# EAGLE design BMP280_breakout (EAGLE 7.2.0)
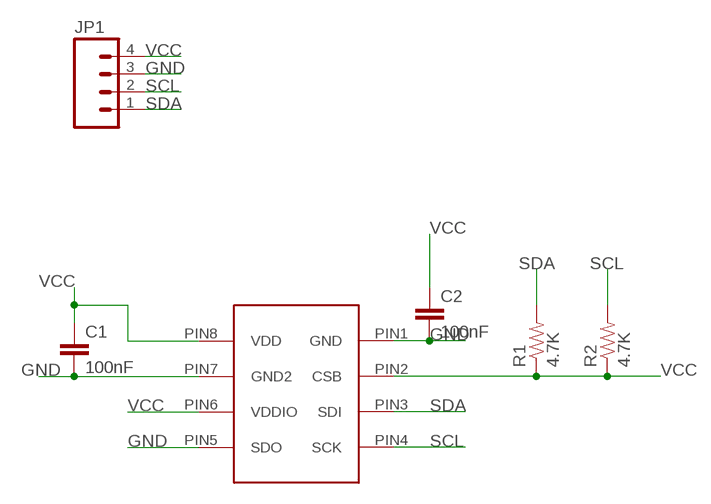
[diagram p0: schematic, sheet 1]

## Parts
C1  100nF  CAP0603-CAP  [0603-CAP]
C2  100nF  CAP0603-CAP  [0603-CAP]
JP1  M04PTH  [1X04]
R1  4.7K  RESISTOR0603  [0603-RES]
R2  4.7K  RESISTOR0603  [0603-RES]
U$1  BMP280  [BMP280]

## Nets
GND: C1.2 C2.2 JP1.3 U$1.PIN1(GND) U$1.PIN5(SDO) U$1.PIN7(GND2)
SCL: JP1.2 R2.2 U$1.PIN4(SCK)
SDA: JP1.1 R1.2 U$1.PIN3(SDI)
VCC: C1.1 C2.1 JP1.4 R1.1 R2.1 U$1.PIN2(CSB) U$1.PIN6(VDDIO) U$1.PIN8(VDD)

## Library data of the parts
C1 C2 = SparkFun-Capacitors:CAP: Capacitor Standard 0603 ceramic capacitor, and 0.1" leaded capacitor.
JP1 = SparkFun-Connectors:M04: Header 4 Standard 4-pin 0.1" header. Use with straight break away headers (SKU : PRT-00116), right angle break away headers (PRT-00553), swiss pins (PRT-00743), machine pins (PRT-00117), and female headers (PRT-00115). Molex polarized connector foot print use with SKU : PRT-08231 with associated crimp pins and housings. 1MM SMD Version SKU: PRT-10208
R1 R2 = SparkFun-Resistors:RESISTOR: Resistor Basic schematic elements and footprints for 0603, 1206, and PTH resistors.
U$1 = open_source_turbidimeter:BMP280

## Board
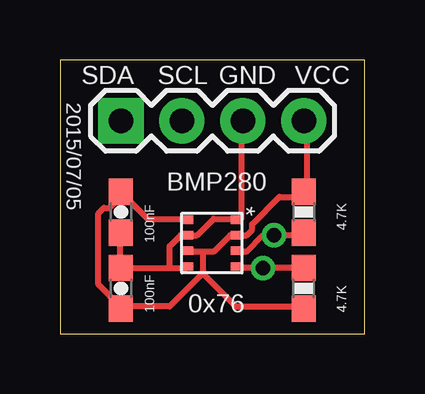
[diagram p1: board, top side]
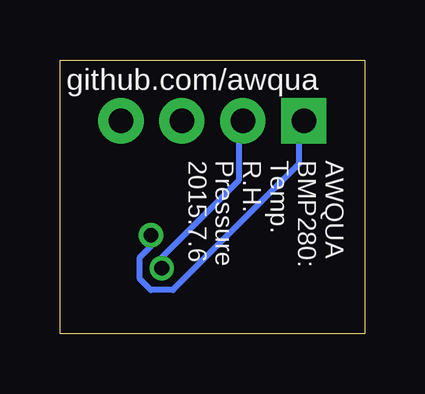
[diagram p2: board, bottom side, seen from below]

Size 12.7 x 11.43 mm. Coordinates in mm from the lower left corner, seen from the top.
Outline: 0,0 12.7,0 12.7,11.43 0,11.42 0,0
Copper layers (1*16): Top 0.035mm / dielectric 1.5mm / Bottom 0.035mm
Design rules "default": minimum track width 10mil, minimum drill 24mil, track to track 8mil, track to pad 8mil, pad to pad 8mil, via to via 8mil, smd to smd 8mil, copper to edge 40mil, drill to drill 8mil, minimum pad ring 10mil, minimum via ring 8mil, stop-mask expansion 4mil, vias tented up to drill 0mil, thermal gap 10mil

### Footprints (pad centres in the part's own frame; a part is rotated, then mirrored left to right if it is on the bottom)
0603-CAP = smd 1.1 x 1: 1 -0.85,0; 2 0.85,0
1X04 = drill 1.016 pad 1.88 square: 1 0,0 | drill 1.016 pad 1.88: 2 2.54,0; 3 5.08,0; 4 7.62,0
0603-RES = smd 1.1 x 1: 1 -0.85,0; 2 0.85,0
BMP280 = smd 0.5 x 0.35: PIN1 2.275,2.225; PIN2 2.275,1.575; PIN3 2.275,0.925; PIN4 2.275,0.275; PIN5 0.225,0.275; PIN6 0.225,0.925; PIN7 0.225,1.575; PIN8 0.225,2.225

### Placement (x,y rotation side)
C1  2.54,5.08 270 top
C2  2.54,1.91 90 top
JP1  2.54,8.89 0 top
R1  10.16,5.08 270 top
R2  10.16,1.91 90 top
U$1  5.08,2.54 0 top

### Tracks (layer width: path | path; a pad name or v marks a point on that pad's centre or on a via)
GND
  Top 0.254: 4.57,2.74 2.74,2.74 C2.2 2.52,2.97 2.52,4.12 C1.2 | 4.57,2.74 5.26,2.74 U$1.PIN5 | 4.57,2.74 4.57,3.66 5.03,4.12 5.26,4.12 U$1.PIN7 5.49,4.12 5.71,4.12 6.4,4.8 7.32,4.8 U$1.PIN1 7.54,4.8 7.54,8.69 JP1.3
SCL  (via drill 0.61)
  Top 0.254: U$1.PIN4 7.54,2.74 v8.46,2.74 10.06,2.74 R2.2
  Bottom 0.254: v8.46,2.74 8.46,3.2 5.26,6.4 5.26,8.69 JP1.2
SDA  (via drill 0.61)
  Top 0.254: U$1.PIN3 7.54,3.43 7.77,3.43 8.46,4.12 v8.91,4.12 10.06,4.12 R1.2
  Bottom 0.254: v8.91,4.12 8.91,3.66 9.37,3.2 9.37,2.29 8.91,1.83 8,1.83 2.74,7.09 2.74,8.69 JP1.1
VCC
  Top 0.254: JP1.4 10.29,8.69 10.29,5.94 R1.1 10.06,5.71 9.14,5.71 8,4.57 8,4.34 7.77,4.12 7.54,4.12 U$1.PIN2 7.32,4.12 7.09,4.12 6.4,3.43 5.94,3.43 | U$1.PIN8 5.26,4.8 3.66,4.8 2.74,5.71 C1.1 2.52,5.71 2.06,5.26 1.83,5.26 1.6,5.03 1.6,2.06 2.52,1.14 C2.1 2.74,1.14 4.57,1.14 5.94,2.52 | 5.94,3.43 5.49,3.43 U$1.PIN6 | 5.94,3.43 5.94,2.52 | 5.94,2.52 7.32,1.14 10.06,1.14 R2.1

### Text on the board
tNames: 2015/07/05 | SDA | SCL | GND | VCC | BMP280 | * | 0x76
bNames: github.com/awqua | AWQUA / BMP280: / Temp. / R.H. / Pressure / 2015.7.6